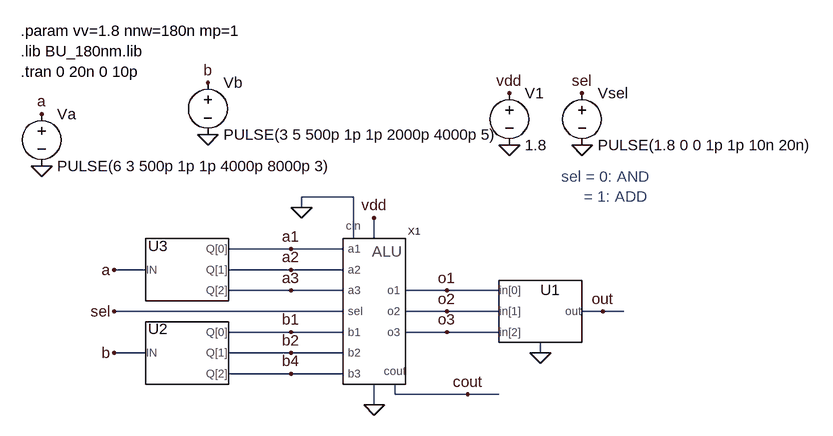
[diagram p0: schematic alu_test_trans.asc]
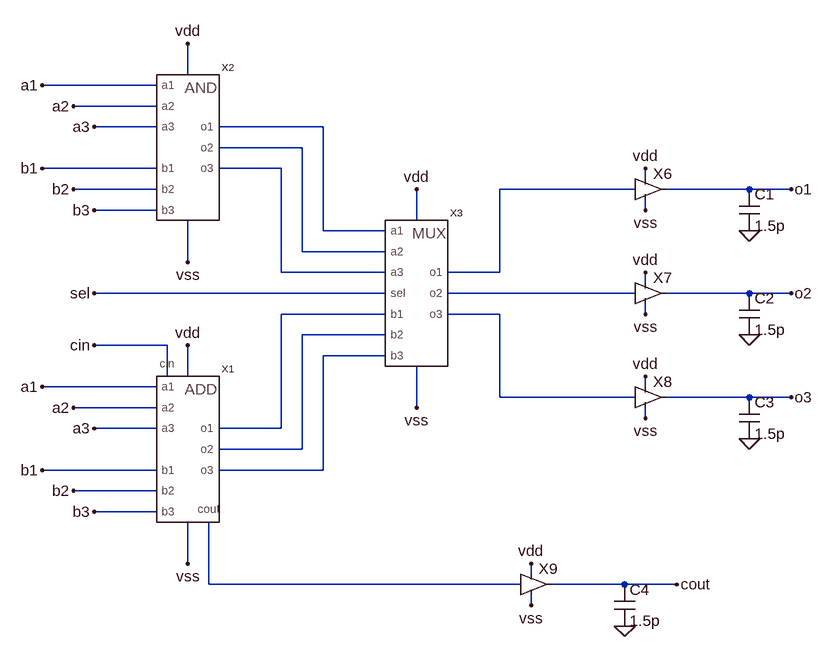
[diagram p1: sub-circuit alu.asc]
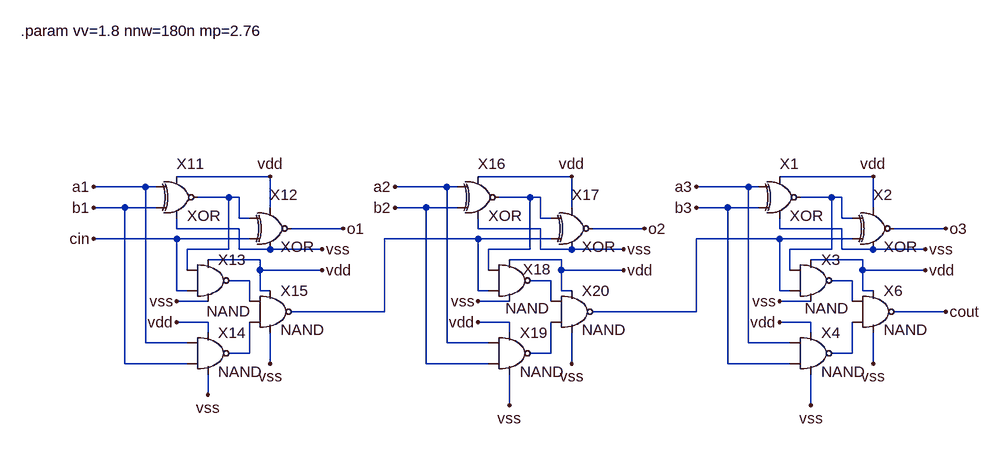
[diagram p2: sub-circuit add3b.asc]
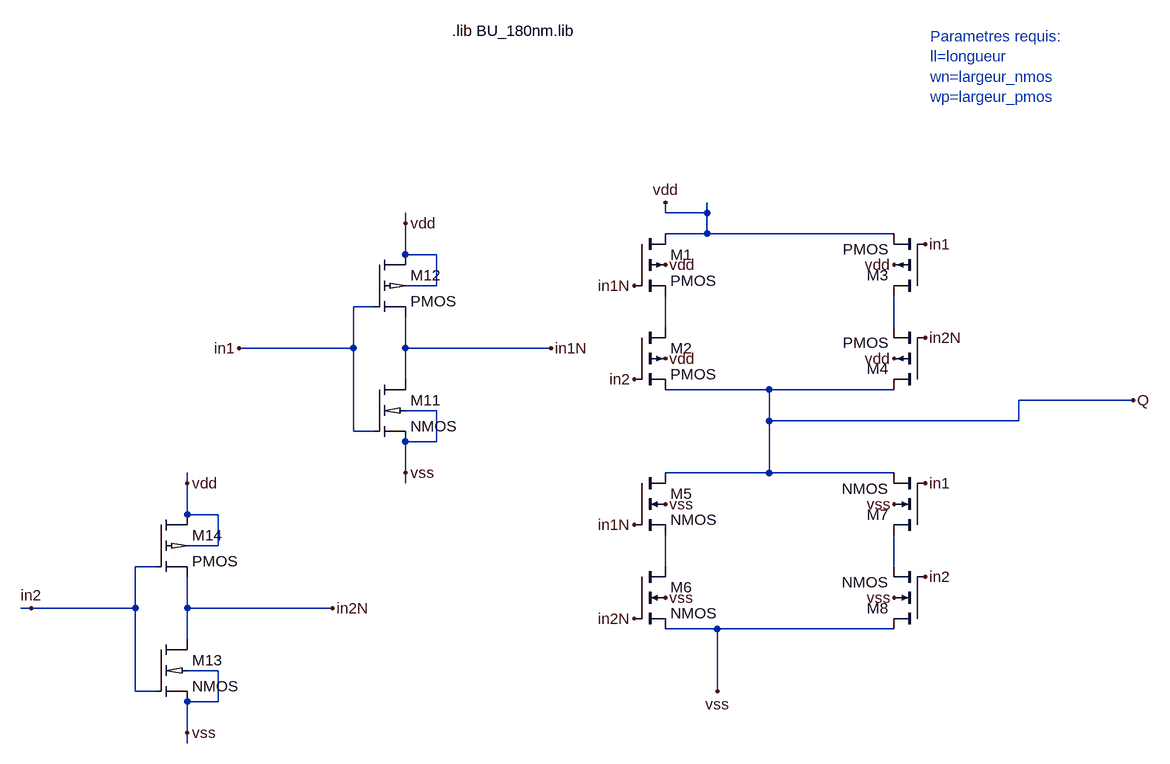
[diagram p3: sub-circuit xor.asc]
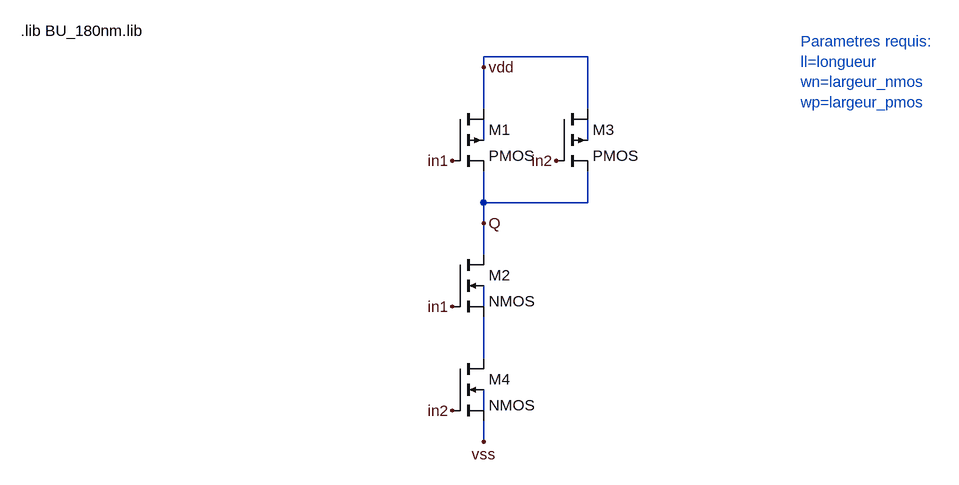
[diagram p4: sub-circuit nand.asc]
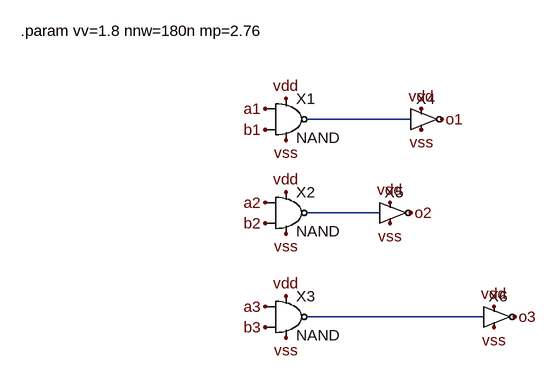
[diagram p5: sub-circuit and3b.asc]
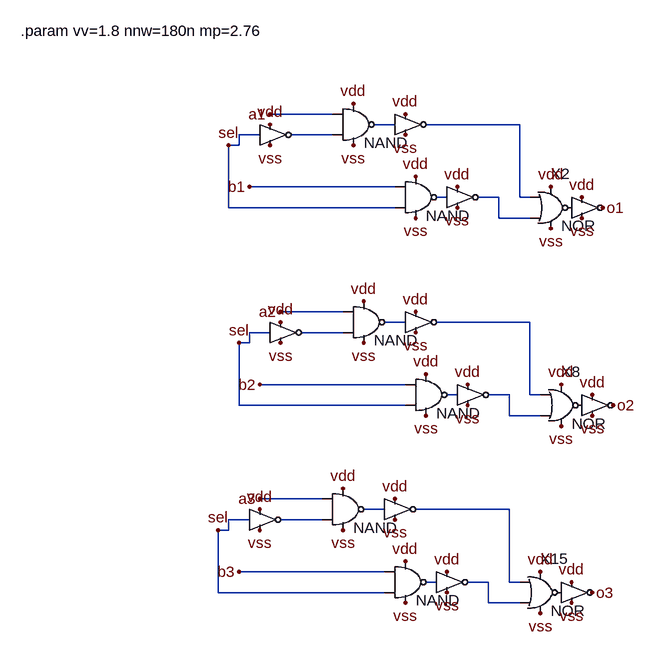
[diagram p6: sub-circuit mux2x3b.asc]
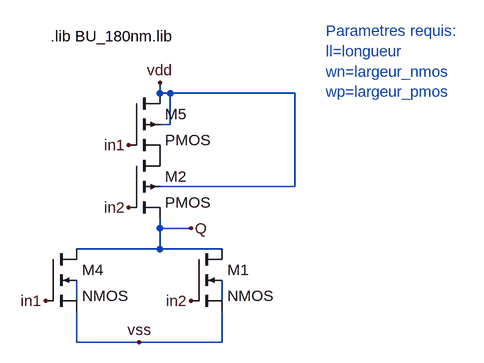
[diagram p7: sub-circuit nor.asc]
alu_test_trans.asc, the LTspice schematic file:
Version 4
SHEET 1 1096 680
WIRE 368 64 288 64
WIRE 288 80 288 64
WIRE 368 128 368 64
WIRE 400 128 400 96
WIRE 272 144 176 144
WIRE 352 144 272 144
WIRE 48 176 0 176
WIRE 272 176 176 176
WIRE 352 176 272 176
WIRE 272 208 176 208
WIRE 352 208 272 208
WIRE 512 208 448 208
WIRE 592 208 512 208
WIRE 352 240 0 240
WIRE 512 240 448 240
WIRE 592 240 512 240
WIRE 752 240 720 240
WIRE 784 240 752 240
WIRE 272 272 176 272
WIRE 352 272 272 272
WIRE 512 272 448 272
WIRE 592 272 512 272
WIRE 48 304 0 304
WIRE 272 304 176 304
WIRE 352 304 272 304
WIRE 656 304 656 288
WIRE 272 336 176 336
WIRE 352 336 272 336
WIRE 432 368 432 352
WIRE 544 368 432 368
WIRE 592 368 544 368
WIRE 400 384 400 352
FLAG 752 240 out
FLAG 400 96 vdd
FLAG 400 384 0
FLAG 608 -16 0
FLAG -112 16 0
FLAG 144 -32 0
FLAG 608 -96 vdd
FLAG -112 -64 a
FLAG 144 -112 b
FLAG 0 176 a
FLAG 0 304 b
FLAG 720 -16 0
FLAG 720 -96 sel
FLAG 0 240 sel
FLAG 288 80 0
FLAG 544 368 cout
FLAG 512 208 o1
FLAG 512 240 o2
FLAG 512 272 o3
FLAG 272 144 a1
FLAG 272 176 a2
FLAG 272 208 a3
FLAG 272 272 b1
FLAG 272 304 b2
FLAG 272 336 b4
FLAG 656 304 0
SYMBOL alu 400 240 R0
SYMATTR InstName X1
SYMBOL Bin2Dec 656 240 R0
SYMATTR InstName U1
SYMATTR SpiceLine Vhigh={vv}
SYMBOL Dec2Bin 112 304 R0
SYMATTR InstName U2
SYMATTR SpiceLine Vhigh={vv}
SYMBOL Dec2Bin 112 176 R0
SYMATTR InstName U3
SYMATTR SpiceLine Vhigh={vv}
SYMBOL /voltage 608 -112 R0
SYMATTR InstName V1
SYMATTR Value 1.8
SYMBOL /voltage -112 -80 R0
SYMATTR InstName Va
SYMATTR Value PULSE(6 3 500p 1p 1p 4000p 8000p 3)
SYMBOL /voltage 144 -128 R0
SYMATTR InstName Vb
SYMATTR Value PULSE(3 5 500p 1p 1p 2000p 4000p 5)
SYMBOL /voltage 720 -112 R0
WINDOW 123 0 0 Left 0
WINDOW 39 0 0 Left 0
SYMATTR InstName Vsel
SYMATTR Value PULSE(1.8 0 0 1p 1p 10n 20n)
TEXT -144 -192 Left 2 !.param vv=1.8 nnw=180n mp=1\n.lib BU_180nm.lib\n.tran 0 20n 0 10p
TEXT 688 32 Left 2 ;sel = 0: AND\n     = 1: ADD

alu.asc, the sub-circuit schematic file:
Version 4
SHEET 1 880 1032
WIRE -896 112 -896 64
WIRE -944 128 -1120 128
WIRE -944 160 -1072 160
WIRE -944 192 -1040 192
WIRE -688 192 -848 192
WIRE -720 224 -848 224
WIRE -944 256 -1120 256
WIRE -752 256 -848 256
WIRE -192 272 -192 256
WIRE -944 288 -1072 288
WIRE -208 288 -416 288
WIRE -32 288 -160 288
WIRE 32 288 -32 288
WIRE -944 320 -1040 320
WIRE -192 320 -192 304
WIRE -544 336 -544 288
WIRE -688 352 -688 192
WIRE -592 352 -688 352
WIRE -720 384 -720 224
WIRE -592 384 -720 384
WIRE -896 400 -896 336
WIRE -752 416 -752 256
WIRE -592 416 -752 416
WIRE -416 416 -416 288
WIRE -416 416 -496 416
WIRE -192 432 -192 416
WIRE -592 448 -1040 448
WIRE -208 448 -496 448
WIRE -32 448 -160 448
WIRE 32 448 -32 448
WIRE -592 480 -752 480
WIRE -416 480 -496 480
WIRE -192 480 -192 464
WIRE -592 512 -720 512
WIRE -928 528 -1040 528
WIRE -592 544 -688 544
WIRE -928 576 -928 528
WIRE -896 576 -896 528
WIRE -944 592 -1120 592
WIRE -192 592 -192 576
WIRE -416 608 -416 480
WIRE -208 608 -416 608
WIRE -32 608 -160 608
WIRE 32 608 -32 608
WIRE -944 624 -1072 624
WIRE -544 624 -544 560
WIRE -192 640 -192 624
WIRE -944 656 -1040 656
WIRE -752 656 -752 480
WIRE -752 656 -848 656
WIRE -720 688 -720 512
WIRE -720 688 -848 688
WIRE -944 720 -1120 720
WIRE -688 720 -688 544
WIRE -688 720 -848 720
WIRE -944 752 -1072 752
WIRE -944 784 -1040 784
WIRE -896 864 -896 800
WIRE -864 896 -864 800
WIRE -368 880 -368 864
WIRE -384 896 -864 896
WIRE -224 896 -336 896
WIRE -144 896 -224 896
WIRE -368 928 -368 912
FLAG -896 864 vss
FLAG -896 64 vdd
FLAG 32 288 o1
FLAG 32 448 o2
FLAG 32 608 o3
FLAG -1120 256 b1
FLAG -1072 288 b2
FLAG -1040 320 b3
FLAG -1120 128 a1
FLAG -1072 160 a2
FLAG -1040 192 a3
FLAG -1120 720 b1
FLAG -1072 752 b2
FLAG -1040 784 b3
FLAG -1120 592 a1
FLAG -1072 624 a2
FLAG -1040 656 a3
FLAG -1040 448 sel
FLAG -896 400 vss
FLAG -544 624 vss
FLAG -896 528 vdd
FLAG -544 288 vdd
FLAG -1040 528 cin
FLAG -144 896 cout
FLAG -192 640 vss
FLAG -192 480 vss
FLAG -192 320 vss
FLAG -192 416 vdd
FLAG -192 256 vdd
FLAG -192 576 vdd
FLAG -32 512 0
FLAG -32 672 0
FLAG -32 352 0
FLAG -224 960 0
FLAG -368 928 vss
FLAG -368 864 vdd
SYMBOL add3b -896 688 R0
SYMATTR InstName X1
SYMATTR SpiceLine ll=180n wn={nnw} wp={nnw*mp/2}
SYMBOL and3b -896 224 R0
SYMATTR InstName X2
SYMATTR SpiceLine ll=180n wn={nnw} wp={nnw*mp/2}
SYMBOL mux2x3b -544 448 R0
SYMATTR InstName X3
SYMATTR SpiceLine ll=180n wn={nnw} wp={nnw*mp/2}
SYMBOL pad_buffer -192 288 R0
SYMATTR InstName X6
SYMBOL pad_buffer -192 448 R0
SYMATTR InstName X7
SYMBOL pad_buffer -192 608 R0
SYMATTR InstName X8
SYMBOL /cap -48 288 R0
SYMATTR InstName C1
SYMATTR Value 1.5p
SYMBOL /cap -48 448 R0
SYMATTR InstName C2
SYMATTR Value 1.5p
SYMBOL /cap -48 608 R0
SYMATTR InstName C3
SYMATTR Value 1.5p
SYMBOL /cap -240 896 R0
SYMATTR InstName C4
SYMATTR Value 1.5p
SYMBOL pad_buffer -368 896 R0
SYMATTR InstName X9

add3b.asc, the sub-circuit schematic file:
Version 4
SHEET 1 2196 1352
WIRE 320 -352 176 -352
WIRE 784 -352 640 -352
WIRE 1248 -352 1104 -352
WIRE 128 -336 48 -336
WIRE 144 -336 128 -336
WIRE 592 -336 512 -336
WIRE 608 -336 592 -336
WIRE 1056 -336 976 -336
WIRE 1072 -336 1056 -336
WIRE 256 -320 208 -320
WIRE 272 -320 256 -320
WIRE 720 -320 672 -320
WIRE 736 -320 720 -320
WIRE 1184 -320 1136 -320
WIRE 1200 -320 1184 -320
WIRE 96 -304 48 -304
WIRE 144 -304 96 -304
WIRE 320 -304 320 -352
WIRE 560 -304 512 -304
WIRE 608 -304 560 -304
WIRE 784 -304 784 -352
WIRE 1024 -304 976 -304
WIRE 1072 -304 1024 -304
WIRE 1248 -304 1248 -352
WIRE 272 -288 272 -320
WIRE 288 -288 272 -288
WIRE 736 -288 736 -320
WIRE 752 -288 736 -288
WIRE 1200 -288 1200 -320
WIRE 1216 -288 1200 -288
WIRE 176 -272 176 -288
WIRE 272 -272 176 -272
WIRE 432 -272 352 -272
WIRE 640 -272 640 -288
WIRE 736 -272 640 -272
WIRE 896 -272 816 -272
WIRE 1104 -272 1104 -288
WIRE 1200 -272 1104 -272
WIRE 1360 -272 1280 -272
WIRE 176 -256 48 -256
WIRE 288 -256 176 -256
WIRE 640 -256 496 -256
WIRE 752 -256 640 -256
WIRE 1104 -256 976 -256
WIRE 1216 -256 1104 -256
WIRE 256 -240 256 -320
WIRE 256 -240 192 -240
WIRE 272 -240 272 -272
WIRE 320 -240 272 -240
WIRE 400 -240 320 -240
WIRE 720 -240 720 -320
WIRE 720 -240 656 -240
WIRE 736 -240 736 -272
WIRE 784 -240 736 -240
WIRE 864 -240 784 -240
WIRE 1184 -240 1184 -320
WIRE 1184 -240 1120 -240
WIRE 1200 -240 1200 -272
WIRE 1248 -240 1200 -240
WIRE 1328 -240 1248 -240
WIRE 304 -224 224 -224
WIRE 768 -224 688 -224
WIRE 1232 -224 1152 -224
WIRE 192 -208 192 -240
WIRE 304 -208 304 -224
WIRE 400 -208 304 -208
WIRE 656 -208 656 -240
WIRE 768 -208 768 -224
WIRE 864 -208 768 -208
WIRE 1120 -208 1120 -240
WIRE 1232 -208 1232 -224
WIRE 1328 -208 1232 -208
WIRE 288 -192 256 -192
WIRE 752 -192 720 -192
WIRE 1216 -192 1184 -192
WIRE 176 -176 176 -256
WIRE 192 -176 176 -176
WIRE 304 -176 304 -208
WIRE 320 -176 304 -176
WIRE 640 -176 640 -256
WIRE 656 -176 640 -176
WIRE 768 -176 768 -208
WIRE 784 -176 768 -176
WIRE 1104 -176 1104 -256
WIRE 1120 -176 1104 -176
WIRE 1232 -176 1232 -208
WIRE 1248 -176 1232 -176
WIRE 224 -160 176 -160
WIRE 288 -160 288 -192
WIRE 688 -160 640 -160
WIRE 752 -160 752 -192
WIRE 1152 -160 1104 -160
WIRE 1216 -160 1216 -192
WIRE 496 -144 496 -256
WIRE 496 -144 352 -144
WIRE 976 -144 976 -256
WIRE 976 -144 816 -144
WIRE 1360 -144 1280 -144
WIRE 224 -128 176 -128
WIRE 688 -128 640 -128
WIRE 1152 -128 1104 -128
WIRE 224 -112 224 -128
WIRE 688 -112 688 -128
WIRE 1152 -112 1152 -128
WIRE 128 -96 128 -336
WIRE 192 -96 128 -96
WIRE 592 -96 592 -336
WIRE 656 -96 592 -96
WIRE 1056 -96 1056 -336
WIRE 1120 -96 1056 -96
WIRE 288 -80 288 -128
WIRE 288 -80 256 -80
WIRE 752 -80 752 -128
WIRE 752 -80 720 -80
WIRE 1216 -80 1216 -128
WIRE 1216 -80 1184 -80
WIRE 96 -64 96 -304
WIRE 192 -64 96 -64
WIRE 320 -64 320 -112
WIRE 560 -64 560 -304
WIRE 656 -64 560 -64
WIRE 784 -64 784 -112
WIRE 1024 -64 1024 -304
WIRE 1120 -64 1024 -64
WIRE 1248 -64 1248 -112
WIRE 224 -16 224 -48
WIRE 688 0 688 -48
WIRE 1152 0 1152 -48
FLAG 1360 -144 cout
FLAG 432 -272 o1
FLAG 896 -272 o2
FLAG 1360 -272 o3
FLAG 976 -336 a3
FLAG 976 -304 b3
FLAG 1248 -352 vdd
FLAG 1328 -208 vdd
FLAG 1104 -128 vdd
FLAG 1152 0 vss
FLAG 1248 -64 vss
FLAG 1104 -160 vss
FLAG 1328 -240 vss
FLAG 48 -336 a1
FLAG 48 -304 b1
FLAG 48 -256 cin
FLAG 320 -352 vdd
FLAG 400 -208 vdd
FLAG 176 -128 vdd
FLAG 224 -16 vss
FLAG 320 -64 vss
FLAG 176 -160 vss
FLAG 400 -240 vss
FLAG 512 -336 a2
FLAG 512 -304 b2
FLAG 784 -352 vdd
FLAG 864 -208 vdd
FLAG 640 -128 vdd
FLAG 688 0 vss
FLAG 784 -64 vss
FLAG 640 -160 vss
FLAG 864 -240 vss
SYMBOL xor 1104 -320 R0
SYMATTR InstName X1
SYMATTR SpiceLine ll=180n wn={nnw} wp={nnw*mp}
SYMBOL xor 1248 -272 R0
SYMATTR InstName X2
SYMATTR SpiceLine ll=180n wn={nnw} wp={nnw*mp}
SYMBOL nand 1152 -192 R0
WINDOW 3 -9 43 Left 2
SYMATTR InstName X3
SYMATTR SpiceLine ll=180n wn={nnw} wp={nnw*mp}
SYMBOL nand 1152 -80 R0
SYMATTR InstName X4
SYMATTR SpiceLine ll=180n wn={nnw} wp={nnw*mp}
SYMBOL nand 1248 -144 R0
SYMATTR InstName X6
SYMATTR SpiceLine ll=180n wn={nnw} wp={nnw*mp}
SYMBOL xor 176 -320 R0
SYMATTR InstName X11
SYMATTR SpiceLine ll=180n wn={nnw} wp={nnw*mp}
SYMBOL xor 320 -272 R0
SYMATTR InstName X12
SYMATTR SpiceLine ll=180n wn={nnw} wp={nnw*mp}
SYMBOL nand 224 -192 R0
WINDOW 3 -2 47 Left 2
SYMATTR InstName X13
SYMATTR SpiceLine ll=180n wn={nnw} wp={nnw*mp}
SYMBOL nand 224 -80 R0
SYMATTR InstName X14
SYMATTR SpiceLine ll=180n wn={nnw} wp={nnw*mp}
SYMBOL nand 320 -144 R0
SYMATTR InstName X15
SYMATTR SpiceLine ll=180n wn={nnw} wp={nnw*mp}
SYMBOL xor 640 -320 R0
SYMATTR InstName X16
SYMATTR SpiceLine ll=180n wn={nnw} wp={nnw*mp}
SYMBOL xor 784 -272 R0
SYMATTR InstName X17
SYMATTR SpiceLine ll=180n wn={nnw} wp={nnw*mp}
SYMBOL nand 688 -192 R0
WINDOW 3 -6 43 Left 2
WINDOW 0 21 -17 Left 2
SYMATTR InstName X18
SYMATTR SpiceLine ll=180n wn={nnw} wp={nnw*mp}
SYMBOL nand 688 -80 R0
SYMATTR InstName X19
SYMATTR SpiceLine ll=180n wn={nnw} wp={nnw*mp}
SYMBOL nand 784 -144 R0
SYMATTR InstName X20
SYMATTR SpiceLine ll=180n wn={nnw} wp={nnw*mp}
TEXT -64 -576 Left 2 !.param vv=1.8 nnw=180n mp=2.76

xor.asc, the sub-circuit schematic file:
Version 4
SHEET 1 1192 964
WIRE 384 80 384 64
WIRE 448 80 448 64
WIRE 448 80 384 80
WIRE -16 96 -16 80
WIRE 448 112 448 80
WIRE 448 112 384 112
WIRE 736 112 448 112
WIRE -16 144 -16 96
WIRE 32 144 -16 144
WIRE 32 192 32 144
WIRE 32 192 -16 192
WIRE -64 224 -96 224
WIRE 384 256 384 208
WIRE 736 256 736 208
WIRE -96 288 -96 224
WIRE -96 288 -272 288
WIRE -16 288 -16 240
WIRE 208 288 -16 288
WIRE -16 336 -16 288
WIRE 544 352 384 352
WIRE 736 352 544 352
WIRE 1104 368 928 368
WIRE 32 384 -16 384
WIRE 544 400 544 352
WIRE 928 400 928 368
WIRE 928 400 544 400
WIRE -96 416 -96 288
WIRE -64 416 -96 416
WIRE 32 432 32 384
WIRE 32 432 -16 432
WIRE -16 480 -16 432
WIRE 544 480 544 400
WIRE 544 480 384 480
WIRE 736 480 544 480
WIRE -352 496 -352 480
WIRE -16 496 -16 480
WIRE -352 544 -352 496
WIRE -304 544 -352 544
WIRE -304 592 -304 544
WIRE -304 592 -352 592
WIRE -400 624 -432 624
WIRE 384 624 384 576
WIRE 736 624 736 576
WIRE -592 688 -608 688
WIRE -432 688 -432 624
WIRE -432 688 -592 688
WIRE -352 688 -352 640
WIRE -128 688 -352 688
WIRE 464 720 384 720
WIRE 736 720 464 720
WIRE -352 736 -352 688
WIRE -304 784 -352 784
WIRE -432 816 -432 688
WIRE -400 816 -432 816
WIRE 464 816 464 720
WIRE -304 832 -304 784
WIRE -304 832 -352 832
WIRE -352 880 -352 832
WIRE -352 896 -352 880
FLAG 336 192 in1N
FLAG 784 272 in2N
FLAG 464 816 vss
FLAG 384 64 vdd
FLAG 1104 368 Q
FLAG 336 560 in1N
FLAG 784 640 in2
FLAG 336 336 in2
FLAG 784 496 in1
FLAG 784 128 in1
FLAG 336 704 in2N
FLAG -272 288 in1
FLAG -16 96 vdd
FLAG -16 480 vss
FLAG 208 288 in1N
FLAG -352 496 vdd
FLAG -352 880 vss
FLAG -128 688 in2N
FLAG -592 688 in2
FLAG 384 160 vdd
FLAG 736 160 vdd
FLAG 736 304 vdd
FLAG 384 304 vdd
FLAG 736 672 vss
FLAG 736 528 vss
FLAG 384 528 vss
FLAG 384 672 vss
SYMBOL pmos4 336 112 R0
SYMATTR InstName M1
SYMATTR Value2 l={ll} w={2*wp} ad={450n*{wp}} as={450n*{wp}} pd={900n+{wp}} ps={1080n+{wp}}
SYMBOL pmos4 336 256 R0
SYMATTR InstName M2
SYMATTR Value2 l={ll} w={2*wp} ad={450n*{wp}} as={450n*{wp}} pd={900n+{wp}} ps={1080n+{wp}}
SYMBOL pmos4 784 208 R180
SYMATTR InstName M3
SYMATTR Value2 l={ll} w={2*wp} ad={450n*{wp}} as={450n*{wp}} pd={900n+{wp}} ps={1080n+{wp}}
SYMBOL pmos4 784 352 R180
SYMATTR InstName M4
SYMATTR Value2 l={ll} w={2*wp} ad={450n*{wp}} as={450n*{wp}} pd={900n+{wp}} ps={1080n+{wp}}
SYMBOL nmos4 336 480 R0
SYMATTR InstName M5
SYMATTR Value2 l={ll} w={2*wn} ad={450n*{wn}} as={450n*{wn}} pd={900n+{wn}} ps={1080n+{wn}}
SYMBOL nmos4 336 624 R0
SYMATTR InstName M6
SYMATTR Value2 l={ll} w={2*wn} ad={450n*{wn}} as={450n*{wn}} pd={900n+{wn}} ps={1080n+{wn}}
SYMBOL nmos4 784 576 R180
SYMATTR InstName M7
SYMATTR Value2 l={ll} w={2*wn} ad={450n*{wn}} as={450n*{wn}} pd={900n+{wn}} ps={1080n+{wn}}
SYMBOL nmos4 784 720 R180
SYMATTR InstName M8
SYMATTR Value2 l={ll} w={2*wn} ad={450n*{wn}} as={450n*{wn}} pd={900n+{wn}} ps={1080n+{wn}}
SYMBOL nmos018 -64 336 R0
SYMATTR InstName M11
SYMATTR Value2 l={ll} w={wn} ad={450n*{wn}} as={450n*{wn}} pd={900n+{wn}} ps={1080n+{wn}}
SYMBOL pmos018 -64 144 R0
SYMATTR InstName M12
SYMATTR Value2 l={ll} w={wp} ad={450n*{wp}} as={450n*{wp}} pd={900n+{wp}} ps={1080n+{wp}}
SYMBOL nmos018 -400 736 R0
SYMATTR InstName M13
SYMATTR Value2 l={ll} w={wn} ad={450n*{wn}} as={450n*{wn}} pd={900n+{wn}} ps={1080n+{wn}}
SYMBOL pmos018 -400 544 R0
SYMATTR InstName M14
SYMATTR Value2 l={ll} w={wp} ad={450n*{wp}} as={450n*{wp}} pd={900n+{wp}} ps={1080n+{wp}}
TEXT 56 -200 Left 2 !.lib BU_180nm.lib
TEXT 792 -192 Left 2 ;Parametres requis: \nll=longueur \nwn=largeur_nmos \nwp=largeur_pmos

nand.asc, the sub-circuit schematic file:
Version 4
SHEET 1 1192 836
WIRE 608 160 448 160
WIRE 448 176 448 160
WIRE 448 240 448 176
WIRE 608 240 608 160
WIRE 448 288 448 256
WIRE 608 288 608 256
WIRE 448 384 448 336
WIRE 608 384 608 336
WIRE 608 384 448 384
WIRE 448 416 448 384
WIRE 448 464 448 416
WIRE 448 544 448 512
WIRE 448 624 448 560
WIRE 448 704 448 672
WIRE 448 752 448 720
FLAG 448 176 vdd
FLAG 448 416 Q
FLAG 400 320 in1
FLAG 560 320 in2
FLAG 400 544 in1
FLAG 400 704 in2
FLAG 448 752 vss
SYMBOL pmos4 400 240 R0
SYMATTR InstName M1
SYMATTR Value2 l={ll} w={wp} ad={450n*{wp}} as={450n*{wp}} pd={900n+{wp}} ps={1080n+{wp}}
SYMBOL pmos4 560 240 R0
SYMATTR InstName M3
SYMATTR Value2 l={ll} w={wp} ad={450n*{wp}} as={450n*{wp}} pd={900n+{wp}} ps={1080n+{wp}}
SYMBOL nmos4 400 464 R0
SYMATTR InstName M2
SYMATTR Value2 l={ll} w={2*wn} ad={450n*{wn}} as={450n*{wn}} pd={900n+{wn}} ps={1080n+{wn}}
SYMBOL nmos4 400 624 R0
SYMATTR InstName M4
SYMATTR Value2 l={ll} w={2*wn} ad={450n*{wn}} as={450n*{wn}} pd={900n+{wn}} ps={1080n+{wn}}
TEXT -264 120 Left 2 !.lib BU_180nm.lib
TEXT 936 136 Left 2 ;Parametres requis: \nll=longueur \nwn=largeur_nmos \nwp=largeur_pmos

and3b.asc, the sub-circuit schematic file:
Version 4
SHEET 1 1616 1032
WIRE 704 80 544 80
WIRE 656 224 544 224
WIRE 816 384 544 384
FLAG 480 64 a1
FLAG 480 208 a2
FLAG 480 368 a3
FLAG 480 96 b1
FLAG 480 240 b2
FLAG 480 400 b3
FLAG 752 80 o1
FLAG 704 224 o2
FLAG 864 384 o3
FLAG 720 64 vdd
FLAG 512 112 vss
FLAG 512 256 vss
FLAG 512 416 vss
FLAG 832 400 vss
FLAG 672 240 vss
FLAG 720 96 vss
FLAG 672 208 vdd
FLAG 832 368 vdd
FLAG 512 352 vdd
FLAG 512 192 vdd
FLAG 512 48 vdd
SYMBOL nand 512 80 R0
SYMATTR InstName X1
SYMATTR SpiceLine ll=180n wn={nnw} wp={nnw*mp}
SYMBOL nand 512 224 R0
SYMATTR InstName X2
SYMATTR SpiceLine ll=180n wn={nnw} wp={nnw*mp}
SYMBOL nand 512 384 R0
SYMATTR InstName X3
SYMATTR SpiceLine ll=180n wn={nnw} wp={nnw*mp}
SYMBOL inv 720 80 R0
SYMATTR InstName X4
SYMATTR SpiceLine ll=180n wn={nnw} wp={nnw*mp}
SYMBOL inv 672 224 R0
SYMATTR InstName X5
SYMATTR SpiceLine ll=180n wn={nnw} wp={nnw*mp}
SYMBOL inv 832 384 R0
SYMATTR InstName X6
SYMATTR SpiceLine ll=180n wn={nnw} wp={nnw*mp}
TEXT 104 -56 Left 2 !.param vv=1.8 nnw=180n mp=2.76

mux2x3b.asc, the sub-circuit schematic file:
Version 4
SHEET 1 2976 2984
WIRE 1280 608 1184 608
WIRE 1376 624 1344 624
WIRE 1568 624 1424 624
WIRE 1168 640 1136 640
WIRE 1280 640 1216 640
WIRE 1136 656 1136 640
WIRE 1136 656 1120 656
WIRE 1376 720 1152 720
WIRE 1456 736 1440 736
WIRE 1536 736 1504 736
WIRE 1568 736 1568 624
WIRE 1584 736 1568 736
WIRE 1120 752 1120 656
WIRE 1376 752 1120 752
WIRE 1536 768 1536 736
WIRE 1584 768 1536 768
WIRE 1296 912 1200 912
WIRE 1392 928 1360 928
WIRE 1584 928 1440 928
WIRE 1184 944 1152 944
WIRE 1296 944 1232 944
WIRE 1152 960 1152 944
WIRE 1152 960 1136 960
WIRE 1392 1024 1168 1024
WIRE 1472 1040 1456 1040
WIRE 1552 1040 1520 1040
WIRE 1584 1040 1584 928
WIRE 1600 1040 1584 1040
WIRE 1136 1056 1136 960
WIRE 1392 1056 1136 1056
WIRE 1552 1072 1552 1040
WIRE 1600 1072 1552 1072
WIRE 1264 1200 1168 1200
WIRE 1360 1216 1328 1216
WIRE 1552 1216 1408 1216
WIRE 1152 1232 1120 1232
WIRE 1264 1232 1200 1232
WIRE 1120 1248 1120 1232
WIRE 1120 1248 1104 1248
WIRE 1360 1312 1136 1312
WIRE 1440 1328 1424 1328
WIRE 1520 1328 1488 1328
WIRE 1552 1328 1552 1216
WIRE 1568 1328 1552 1328
WIRE 1104 1344 1104 1248
WIRE 1360 1344 1104 1344
WIRE 1520 1360 1520 1328
WIRE 1568 1360 1520 1360
FLAG 1184 608 a1
FLAG 1152 720 b1
FLAG 1120 656 sel
FLAG 1392 640 vss
FLAG 1312 656 vss
FLAG 1184 656 vss
FLAG 1408 768 vss
FLAG 1472 752 vss
FLAG 1616 784 vss
FLAG 1184 624 vdd
FLAG 1312 592 vdd
FLAG 1392 608 vdd
FLAG 1408 704 vdd
FLAG 1472 720 vdd
FLAG 1616 720 vdd
FLAG 1664 768 vss
FLAG 1664 736 vdd
FLAG 1696 752 o1
FLAG 1200 912 a2
FLAG 1168 1024 b2
FLAG 1136 960 sel
FLAG 1408 944 vss
FLAG 1328 960 vss
FLAG 1200 960 vss
FLAG 1424 1072 vss
FLAG 1488 1056 vss
FLAG 1632 1088 vss
FLAG 1200 928 vdd
FLAG 1328 896 vdd
FLAG 1408 912 vdd
FLAG 1424 1008 vdd
FLAG 1488 1024 vdd
FLAG 1632 1024 vdd
FLAG 1680 1072 vss
FLAG 1680 1040 vdd
FLAG 1712 1056 o2
FLAG 1168 1200 a3
FLAG 1136 1312 b3
FLAG 1104 1248 sel
FLAG 1376 1232 vss
FLAG 1296 1248 vss
FLAG 1168 1248 vss
FLAG 1392 1360 vss
FLAG 1456 1344 vss
FLAG 1600 1376 vss
FLAG 1168 1216 vdd
FLAG 1296 1184 vdd
FLAG 1376 1200 vdd
FLAG 1392 1296 vdd
FLAG 1456 1312 vdd
FLAG 1600 1312 vdd
FLAG 1648 1360 vss
FLAG 1648 1328 vdd
FLAG 1680 1344 o3
SYMBOL nor 1616 752 R0
SYMATTR InstName X2
SYMATTR SpiceLine ll=180n wn={nnw} wp={nnw*mp}
SYMBOL inv 1184 640 R0
WINDOW 0 -8 -32 Invisible 2
SYMATTR InstName X3
SYMATTR SpiceLine ll=180n wn={nnw} wp={nnw*mp}
SYMBOL nand 1312 624 R0
WINDOW 0 16 -32 Invisible 2
SYMATTR InstName X1
SYMATTR SpiceLine ll=180n wn={nnw} wp={nnw*mp}
SYMBOL inv 1392 624 R0
WINDOW 0 -8 -32 Invisible 2
SYMATTR InstName X4
SYMATTR SpiceLine ll=180n wn={nnw} wp={nnw*mp}
SYMBOL nand 1408 736 R0
WINDOW 0 16 -32 Invisible 2
SYMATTR InstName X5
SYMATTR SpiceLine ll=180n wn={nnw} wp={nnw*mp}
SYMBOL inv 1472 736 R0
WINDOW 0 -8 -32 Invisible 2
SYMATTR InstName X6
SYMATTR SpiceLine ll=180n wn={nnw} wp={nnw*mp}
SYMBOL inv 1664 752 R0
WINDOW 0 -8 -32 Invisible 2
SYMATTR InstName X7
SYMATTR SpiceLine ll=180n wn={nnw} wp={nnw*mp}
SYMBOL nor 1632 1056 R0
SYMATTR InstName X8
SYMATTR SpiceLine ll=180n wn={nnw} wp={nnw*mp}
SYMBOL inv 1200 944 R0
WINDOW 0 -8 -32 Invisible 2
SYMATTR InstName X9
SYMATTR SpiceLine ll=180n wn={nnw} wp={nnw*mp}
SYMBOL nand 1328 928 R0
WINDOW 0 16 -32 Invisible 2
SYMATTR InstName X10
SYMATTR SpiceLine ll=180n wn={nnw} wp={nnw*mp}
SYMBOL inv 1408 928 R0
WINDOW 0 -8 -32 Invisible 2
SYMATTR InstName X11
SYMATTR SpiceLine ll=180n wn={nnw} wp={nnw*mp}
SYMBOL nand 1424 1040 R0
WINDOW 0 16 -32 Invisible 2
SYMATTR InstName X12
SYMATTR SpiceLine ll=180n wn={nnw} wp={nnw*mp}
SYMBOL inv 1488 1040 R0
WINDOW 0 -8 -32 Invisible 2
SYMATTR InstName X13
SYMATTR SpiceLine ll=180n wn={nnw} wp={nnw*mp}
SYMBOL inv 1680 1056 R0
WINDOW 0 -8 -32 Invisible 2
SYMATTR InstName X14
SYMATTR SpiceLine ll=180n wn={nnw} wp={nnw*mp}
SYMBOL nor 1600 1344 R0
SYMATTR InstName X15
SYMATTR SpiceLine ll=180n wn={nnw} wp={nnw*mp}
SYMBOL inv 1168 1232 R0
WINDOW 0 -8 -32 Invisible 2
SYMATTR InstName X16
SYMATTR SpiceLine ll=180n wn={nnw} wp={nnw*mp}
SYMBOL nand 1296 1216 R0
WINDOW 0 16 -32 Invisible 2
SYMATTR InstName X17
SYMATTR SpiceLine ll=180n wn={nnw} wp={nnw*mp}
SYMBOL inv 1376 1216 R0
WINDOW 0 -8 -32 Invisible 2
SYMATTR InstName X18
SYMATTR SpiceLine ll=180n wn={nnw} wp={nnw*mp}
SYMBOL nand 1392 1328 R0
WINDOW 0 16 -32 Invisible 2
SYMATTR InstName X19
SYMATTR SpiceLine ll=180n wn={nnw} wp={nnw*mp}
SYMBOL inv 1456 1328 R0
WINDOW 0 -8 -32 Invisible 2
SYMATTR InstName X20
SYMATTR SpiceLine ll=180n wn={nnw} wp={nnw*mp}
SYMBOL inv 1648 1344 R0
WINDOW 0 -8 -32 Invisible 2
SYMATTR InstName X21
SYMATTR SpiceLine ll=180n wn={nnw} wp={nnw*mp}
TEXT 800 480 Left 2 !.param vv=1.8 nnw=180n mp=2.76

nor.asc, the sub-circuit schematic file:
Version 4
SHEET 1 1252 1108
WIRE 320 288 320 272
WIRE 336 288 320 288
WIRE 528 288 336 288
WIRE 336 336 336 288
WIRE 336 336 320 336
WIRE 528 432 528 288
WIRE 528 432 320 432
WIRE 320 496 320 480
WIRE 368 496 320 496
WIRE 320 528 320 496
WIRE 320 528 192 528
WIRE 416 528 320 528
WIRE 192 608 192 576
WIRE 416 608 416 576
WIRE 192 672 192 624
WIRE 288 672 192 672
WIRE 416 672 416 624
WIRE 416 672 288 672
FLAG 320 272 vdd
FLAG 288 672 vss
FLAG 144 608 in1
FLAG 368 608 in2
FLAG 272 464 in2
FLAG 272 368 in1
FLAG 368 496 Q
SYMBOL nmos4 368 528 R0
SYMATTR InstName M1
SYMATTR Value2 l={ll} w={wn} ad={450n*{wn}} as={450n*{wn}} pd={900n+{wn}} ps={1080n+{wn}}
SYMBOL nmos4 144 528 R0
SYMATTR InstName M4
SYMATTR Value2 l={ll} w={2*wn} ad={450n*{wn}} as={450n*{wn}} pd={900n+{wn}} ps={1080n+{wn}}
SYMBOL pmos4 272 288 R0
SYMATTR InstName M5
SYMATTR Value2 l={ll} w={2*wp} ad={450n*{wp}} as={450n*{wp}} pd={900n+{wp}} ps={1080n+{wp}}
SYMBOL pmos4 272 384 R0
SYMATTR InstName M2
SYMATTR Value2 l={ll} w={2*wp} ad={450n*{wp}} as={450n*{wp}} pd={900n+{wp}} ps={1080n+{wp}}
TEXT 152 200 Left 2 !.lib BU_180nm.lib
TEXT 576 192 Left 2 ;Parametres requis: \nll=longueur \nwn=largeur_nmos \nwp=largeur_pmos

The netlist it stands for:
* alu_test_trans.asc
XX1 vdd a1 a2 a3 b1 b2 b4 0 o1 o2 o3 sel cout 0 alu
XU1 o1 o2 o3 out Bin2Dec Vhigh={vv}  ; pins in[0] in[1] in[2] out
XU2 b b1 b2 b4 Dec2Bin Vhigh={vv}  ; pins IN Q[0] Q[1] Q[2]
XU3 a a1 a2 a3 Dec2Bin Vhigh={vv}  ; pins IN Q[0] Q[1] Q[2]
V1 vdd 0 1.8
Va a 0 PULSE(6 3 500p 1p 1p 4000p 8000p 3)
Vb b 0 PULSE(3 5 500p 1p 1p 2000p 4000p 5)
Vsel sel 0 PULSE(1.8 0 0 1p 1p 10n 20n)

* block symbol definitions
.subckt alu vdd a1 a2 a3 b1 b2 b3 vss o1 o2 o3 sel cout cin
XX1 vdd a1 a2 a3 b1 b2 b3 vss N006 N008 N009 N010 cin add3b params: ll=180n wn={nnw} wp={nnw*mp/2}
XX2 vdd a1 a2 a3 b1 b2 b3 vss N001 N002 N003 and3b params: ll=180n wn={nnw} wp={nnw*mp/2}
XX3 vdd N001 N002 N003 N006 N008 N009 vss N004 N005 N007 sel mux2x3b params: ll=180n wn={nnw} wp={nnw*mp/2}
XX6 N004 o1 vdd vss pad_buffer  ; pins In out vdd vss
XX7 N005 o2 vdd vss pad_buffer  ; pins In out vdd vss
XX8 N007 o3 vdd vss pad_buffer  ; pins In out vdd vss
C1 o1 0 1.5p
C2 o2 0 1.5p
C3 o3 0 1.5p
C4 cout 0 1.5p
XX9 N010 cout vdd vss pad_buffer  ; pins In out vdd vss
.ends alu

.subckt add3b vdd a1 a2 a3 b1 b2 b3 vss o1 o2 o3 cout cin
XX1 a3 N003 vdd vss b3 xor params: XOR ll=180n wn={nnw} wp={nnw*mp}
XX2 N003 o3 vdd vss N005 xor params: XOR ll=180n wn={nnw} wp={nnw*mp}
XX3 N003 N008 vdd vss N005 nand params: NAND ll=180n wn={nnw} wp={nnw*mp}
XX4 a3 N011 vdd vss b3 nand params: NAND ll=180n wn={nnw} wp={nnw*mp}
XX6 N008 cout vdd vss N011 nand params: NAND ll=180n wn={nnw} wp={nnw*mp}
XX11 a1 N001 vdd vss b1 xor params: XOR ll=180n wn={nnw} wp={nnw*mp}
XX12 N001 o1 vdd vss cin xor params: XOR ll=180n wn={nnw} wp={nnw*mp}
XX13 N001 N006 vdd vss cin nand params: NAND ll=180n wn={nnw} wp={nnw*mp}
XX14 a1 N009 vdd vss b1 nand params: NAND ll=180n wn={nnw} wp={nnw*mp}
XX15 N006 N004 vdd vss N009 nand params: NAND ll=180n wn={nnw} wp={nnw*mp}
XX16 a2 N002 vdd vss b2 xor params: XOR ll=180n wn={nnw} wp={nnw*mp}
XX17 N002 o2 vdd vss N004 xor params: XOR ll=180n wn={nnw} wp={nnw*mp}
XX18 N002 N007 vdd vss N004 nand params: NAND ll=180n wn={nnw} wp={nnw*mp}
XX19 a2 N010 vdd vss b2 nand params: NAND ll=180n wn={nnw} wp={nnw*mp}
XX20 N007 N005 vdd vss N010 nand params: NAND ll=180n wn={nnw} wp={nnw*mp}
.param vv=1.8 nnw=180n mp=2.76
.ends add3b

.subckt xor in1 Q vdd vss in2
M1 vdd in1N N001 vdd PMOS l={ll} w={2*wp} ad={450n*{wp}} as={450n*{wp}} pd={900n+{wp}} ps={1080n+{wp}}
M2 N001 in2 Q vdd PMOS l={ll} w={2*wp} ad={450n*{wp}} as={450n*{wp}} pd={900n+{wp}} ps={1080n+{wp}}
M3 N002 in1 vdd vdd PMOS l={ll} w={2*wp} ad={450n*{wp}} as={450n*{wp}} pd={900n+{wp}} ps={1080n+{wp}}
M4 Q in2N N002 vdd PMOS l={ll} w={2*wp} ad={450n*{wp}} as={450n*{wp}} pd={900n+{wp}} ps={1080n+{wp}}
M5 Q in1N N003 vss NMOS l={ll} w={2*wn} ad={450n*{wn}} as={450n*{wn}} pd={900n+{wn}} ps={1080n+{wn}}
M6 N003 in2N vss vss NMOS l={ll} w={2*wn} ad={450n*{wn}} as={450n*{wn}} pd={900n+{wn}} ps={1080n+{wn}}
M7 N004 in1 Q vss NMOS l={ll} w={2*wn} ad={450n*{wn}} as={450n*{wn}} pd={900n+{wn}} ps={1080n+{wn}}
M8 vss in2 N004 vss NMOS l={ll} w={2*wn} ad={450n*{wn}} as={450n*{wn}} pd={900n+{wn}} ps={1080n+{wn}}
M11 in1N in1 vss vss NMOS l={ll} w={wn} ad={450n*{wn}} as={450n*{wn}} pd={900n+{wn}} ps={1080n+{wn}}
M12 vdd in1 in1N vdd PMOS l={ll} w={wp} ad={450n*{wp}} as={450n*{wp}} pd={900n+{wp}} ps={1080n+{wp}}
M13 in2N in2 vss vss NMOS l={ll} w={wn} ad={450n*{wn}} as={450n*{wn}} pd={900n+{wn}} ps={1080n+{wn}}
M14 vdd in2 in2N vdd PMOS l={ll} w={wp} ad={450n*{wp}} as={450n*{wp}} pd={900n+{wp}} ps={1080n+{wp}}
.lib BU_180nm.lib
* Parametres requis:
* ll=longueur
* wn=largeur_nmos
* wp=largeur_pmos
.ends xor

.subckt nand in1 Q vdd vss in2
M1 vdd in1 Q N001 PMOS l={ll} w={wp} ad={450n*{wp}} as={450n*{wp}} pd={900n+{wp}} ps={1080n+{wp}}
M3 vdd in2 Q N002 PMOS l={ll} w={wp} ad={450n*{wp}} as={450n*{wp}} pd={900n+{wp}} ps={1080n+{wp}}
M2 Q in1 N004 N003 NMOS l={ll} w={2*wn} ad={450n*{wn}} as={450n*{wn}} pd={900n+{wn}} ps={1080n+{wn}}
M4 N004 in2 vss N005 NMOS l={ll} w={2*wn} ad={450n*{wn}} as={450n*{wn}} pd={900n+{wn}} ps={1080n+{wn}}
.lib BU_180nm.lib
* Parametres requis:
* ll=longueur
* wn=largeur_nmos
* wp=largeur_pmos
.ends nand

.subckt and3b vdd a1 a2 a3 b1 b2 b3 vss o1 o2 o3
XX1 a1 N001 vdd vss b1 nand params: NAND ll=180n wn={nnw} wp={nnw*mp}
XX2 a2 N002 vdd vss b2 nand params: NAND ll=180n wn={nnw} wp={nnw*mp}
XX3 a3 N003 vdd vss b3 nand params: NAND ll=180n wn={nnw} wp={nnw*mp}
XX4 N001 o1 vdd vss inv ll=180n wn={nnw} wp={nnw*mp}  ; pins In _Q vdd vss
XX5 N002 o2 vdd vss inv ll=180n wn={nnw} wp={nnw*mp}  ; pins In _Q vdd vss
XX6 N003 o3 vdd vss inv ll=180n wn={nnw} wp={nnw*mp}  ; pins In _Q vdd vss
.param vv=1.8 nnw=180n mp=2.76
.ends and3b

.subckt mux2x3b vdd a1 a2 a3 b1 b2 b3 vss o1 o2 o3 sel
XX2 N002 P001 vdd vss N005 nor params: NOR ll=180n wn={nnw} wp={nnw*mp}
XX3 sel N003 vdd vss inv ll=180n wn={nnw} wp={nnw*mp}  ; pins In _Q vdd vss
XX1 a1 N001 vdd vss N003 nand params: NAND ll=180n wn={nnw} wp={nnw*mp}
XX4 N001 N002 vdd vss inv ll=180n wn={nnw} wp={nnw*mp}  ; pins In _Q vdd vss
XX5 b1 N004 vdd vss sel nand params: NAND ll=180n wn={nnw} wp={nnw*mp}
XX6 N004 N005 vdd vss inv ll=180n wn={nnw} wp={nnw*mp}  ; pins In _Q vdd vss
XX7 P001 o1 vdd vss inv ll=180n wn={nnw} wp={nnw*mp}  ; pins In _Q vdd vss
XX8 N007 P002 vdd vss N010 nor params: NOR ll=180n wn={nnw} wp={nnw*mp}
XX9 sel N008 vdd vss inv ll=180n wn={nnw} wp={nnw*mp}  ; pins In _Q vdd vss
XX10 a2 N006 vdd vss N008 nand params: NAND ll=180n wn={nnw} wp={nnw*mp}
XX11 N006 N007 vdd vss inv ll=180n wn={nnw} wp={nnw*mp}  ; pins In _Q vdd vss
XX12 b2 N009 vdd vss sel nand params: NAND ll=180n wn={nnw} wp={nnw*mp}
XX13 N009 N010 vdd vss inv ll=180n wn={nnw} wp={nnw*mp}  ; pins In _Q vdd vss
XX14 P002 o2 vdd vss inv ll=180n wn={nnw} wp={nnw*mp}  ; pins In _Q vdd vss
XX15 N012 P003 vdd vss N015 nor params: NOR ll=180n wn={nnw} wp={nnw*mp}
XX16 sel N013 vdd vss inv ll=180n wn={nnw} wp={nnw*mp}  ; pins In _Q vdd vss
XX17 a3 N011 vdd vss N013 nand params: NAND ll=180n wn={nnw} wp={nnw*mp}
XX18 N011 N012 vdd vss inv ll=180n wn={nnw} wp={nnw*mp}  ; pins In _Q vdd vss
XX19 b3 N014 vdd vss sel nand params: NAND ll=180n wn={nnw} wp={nnw*mp}
XX20 N014 N015 vdd vss inv ll=180n wn={nnw} wp={nnw*mp}  ; pins In _Q vdd vss
XX21 P003 o3 vdd vss inv ll=180n wn={nnw} wp={nnw*mp}  ; pins In _Q vdd vss
.param vv=1.8 nnw=180n mp=2.76
.ends mux2x3b

.subckt nor in1 Q vdd vss in2
M1 Q in2 vss N002 NMOS l={ll} w={wn} ad={450n*{wn}} as={450n*{wn}} pd={900n+{wn}} ps={1080n+{wn}}
M4 Q in1 vss N001 NMOS l={ll} w={2*wn} ad={450n*{wn}} as={450n*{wn}} pd={900n+{wn}} ps={1080n+{wn}}
M5 vdd in1 P001 vdd PMOS l={ll} w={2*wp} ad={450n*{wp}} as={450n*{wp}} pd={900n+{wp}} ps={1080n+{wp}}
M2 P001 in2 Q vdd PMOS l={ll} w={2*wp} ad={450n*{wp}} as={450n*{wp}} pd={900n+{wp}} ps={1080n+{wp}}
.lib BU_180nm.lib
* Parametres requis:
* ll=longueur
* wn=largeur_nmos
* wp=largeur_pmos
.ends nor

.model NMOS NMOS
.model PMOS PMOS
.lib standard.mos
.param vv=1.8 nnw=180n mp=1
.lib BU_180nm.lib
.tran 0 20n 0 10p
* sel = 0: AND
*      = 1: ADD
.lib alu.asc
.lib add3b.asc
.lib BU_180nm.lib
.lib and3b.asc
.lib mux2x3b.asc
.lib Bin2Dec.sub
.lib Dec2Bin.sub
.backanno
.end